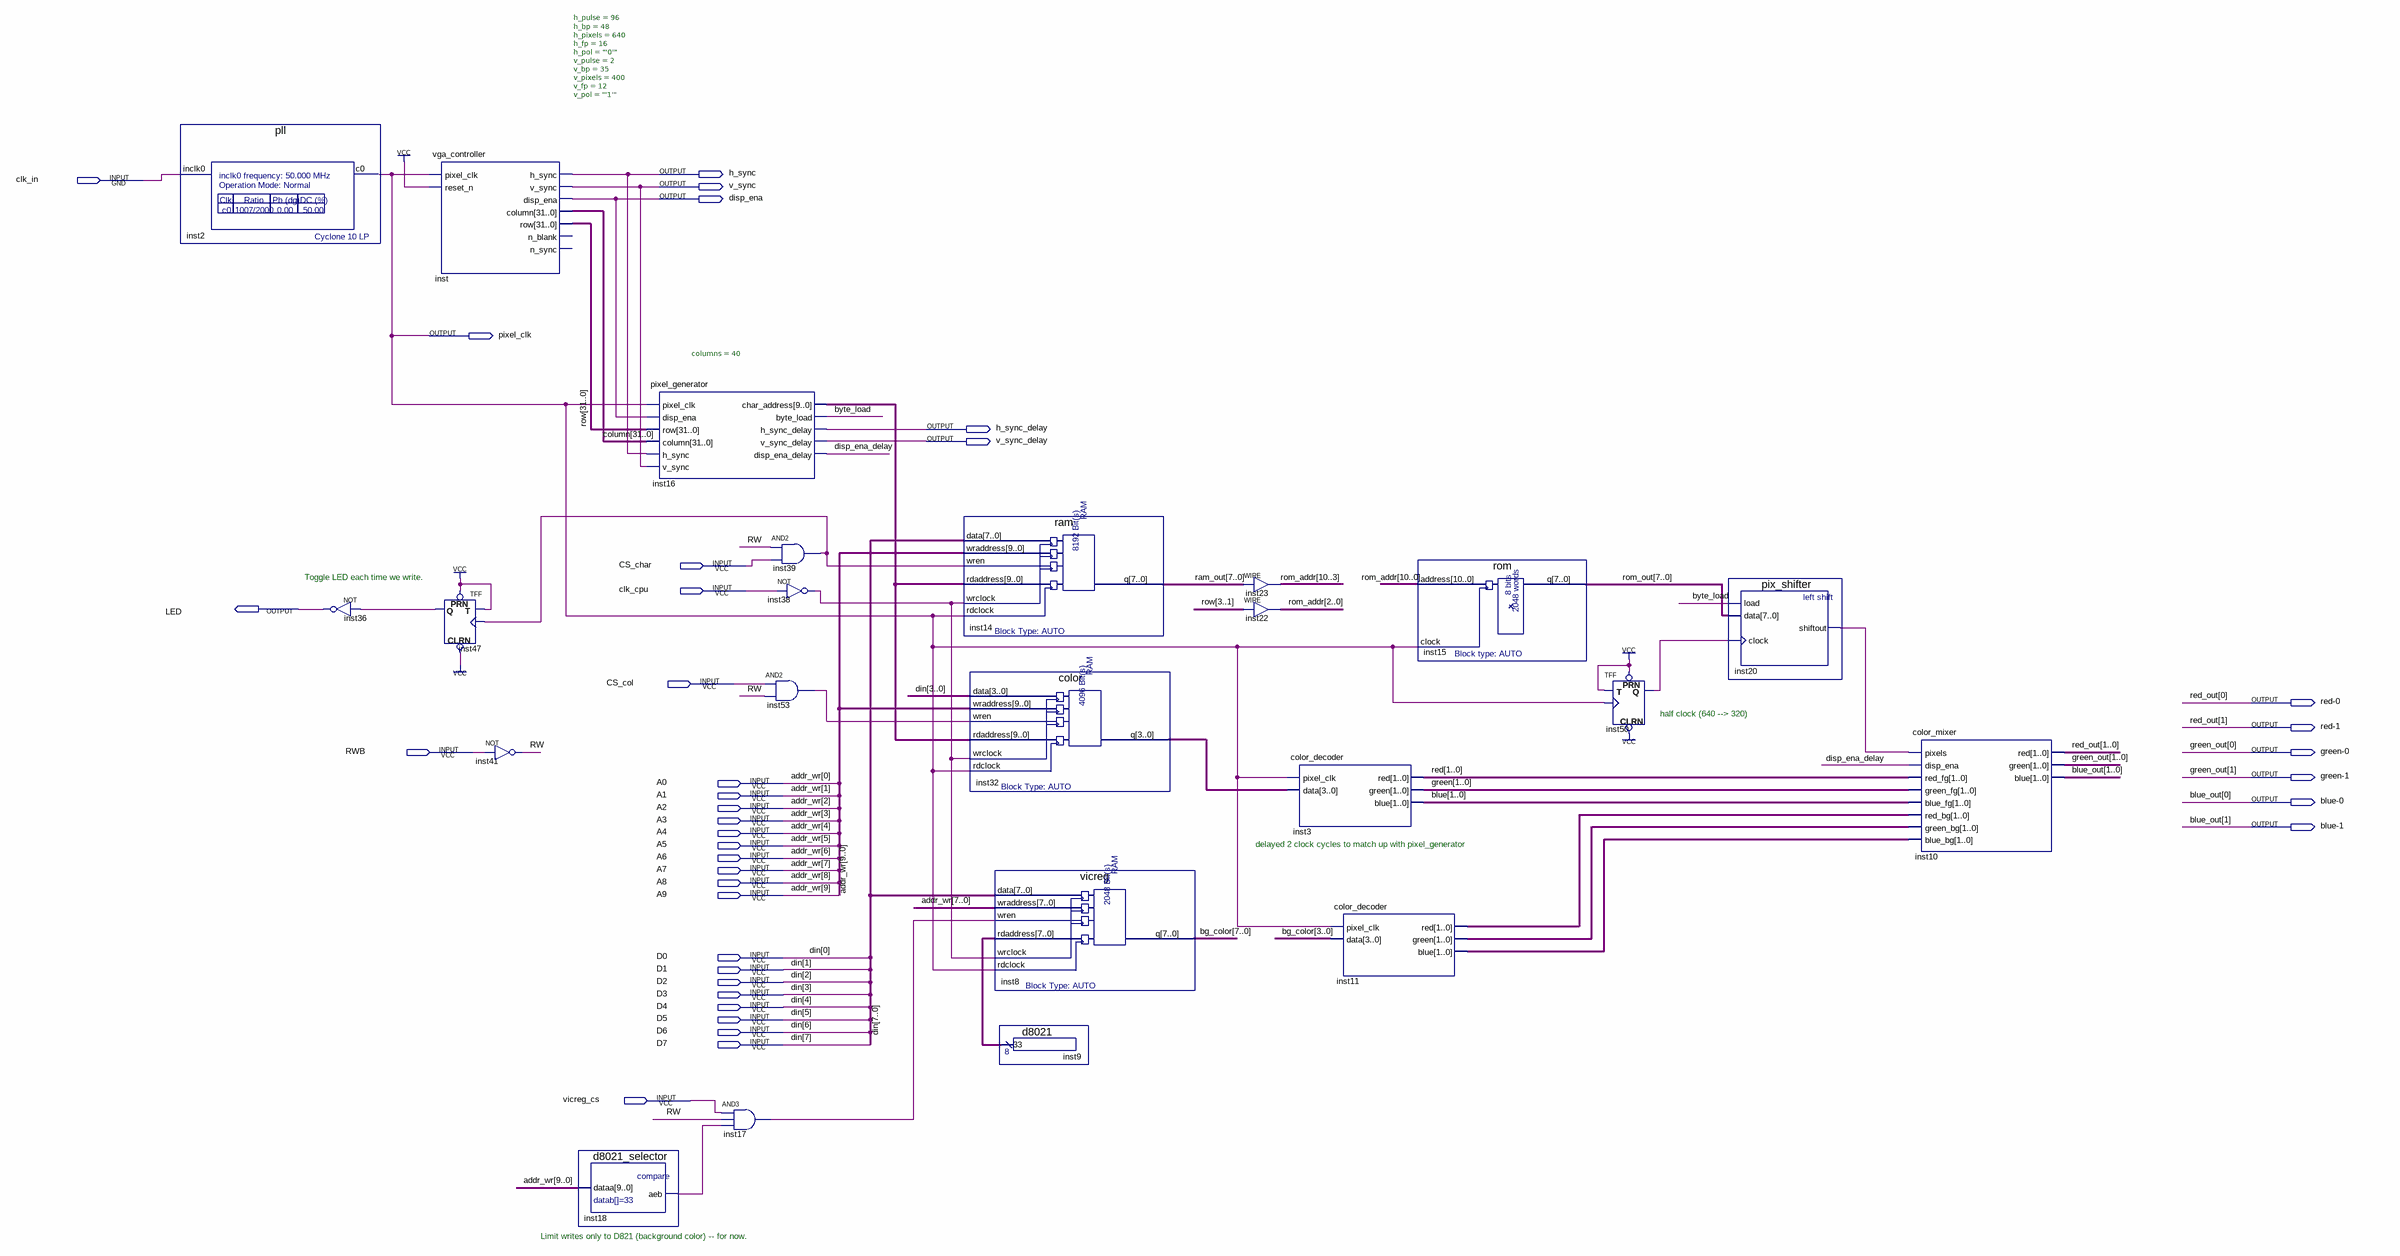
[diagram p0: schematic sheet]
// Quartus schematic VGA.bdf as structural Verilog: 23 symbols, 37 pins
module VGA (
  input  clk_in,
  input  CS_char,
  input  clk_cpu,
  input  CS_col,
  input  RWB,
  input  A0,
  input  A1,
  input  A2,
  input  A3,
  input  A4,
  input  A5,
  input  A6,
  input  A7,
  input  A8,
  input  A9,
  input  D0,
  input  D1,
  input  D2,
  input  D3,
  input  D4,
  input  D5,
  input  D6,
  input  D7,
  input  vicreg_cs,
  output h_sync,
  output v_sync,
  output disp_ena,
  output pixel_clk,
  output h_sync_delay,
  output v_sync_delay,
  output LED,
  output \red-0 ,
  output \red-1 ,
  output \green-0 ,
  output \green-1 ,
  output \blue-0 ,
  output \blue-1 
);

  wire byte_load, disp_ena_delay, inst17_out, inst18_aeb, inst20_shiftout, inst38_out, inst39_out, inst47_q,
       inst50_q, inst53_out, RW;
  wire [1:0] blue, green, inst11_blue, inst11_green, inst11_red, red;
  wire [3:0] inst32_q;
  wire [7:0] bg_color, inst9_result, ram_out, rom_out;
  wire [9:0] inst16_char_address;
  wire [10:0] rom_addr;
  wire [31:0] column, row;

  pll inst2 (.inclk0(clk_in), .c0(pixel_clk));
  not inst36 (LED, inst47_q);
  vga_controller #(.h_pulse(96), .h_bp(48), .h_pixels(640), .h_fp(16), .h_pol("'0'"), .v_pulse(2), .v_bp(35), .v_pixels(400), .v_fp(12), .v_pol("'1'")) inst (
    .pixel_clk(pixel_clk), .reset_n(1'b1), .h_sync(h_sync), .v_sync(v_sync), .disp_ena(disp_ena),
    .column(column), .row(row));  // open: n_blank, n_sync
  TFF inst47 (.PRN(1'b1), .CLRN(1'b1), .T(1'b1), .CLK(inst39_out), .Q(inst47_q));
  not inst41 (RW, RWB);
  d8021_selector inst18 (.dataa({A9, A8, A7, A6, A5, A4, A3, A2, A1, A0}), .aeb(inst18_aeb));
  pixel_generator #(.columns(40)) inst16 (
    .pixel_clk(pixel_clk), .disp_ena(disp_ena), .row(row), .column(column), .h_sync(h_sync), .v_sync(v_sync),
    .char_address(inst16_char_address), .byte_load(byte_load), .h_sync_delay(h_sync_delay),
    .v_sync_delay(v_sync_delay), .disp_ena_delay(disp_ena_delay));
  and inst17 (inst17_out, vicreg_cs, RW, inst18_aeb);
  and inst39 (inst39_out, RW, CS_char);
  not inst38 (inst38_out, clk_cpu);
  and inst53 (inst53_out, CS_col, RW);
  ram inst14 (
    .data({D7, D6, D5, D4, D3, D2, D1, D0}), .wraddress({A9, A8, A7, A6, A5, A4, A3, A2, A1, A0}),
    .wren(inst39_out), .rdaddress(inst16_char_address), .wrclock(inst38_out), .rdclock(pixel_clk), .q(ram_out));
  color inst32 (
    .data({D3, D2, D1, D0}), .wraddress({A9, A8, A7, A6, A5, A4, A3, A2, A1, A0}), .wren(inst53_out),
    .rdaddress(inst16_char_address), .wrclock(inst38_out), .rdclock(pixel_clk), .q(inst32_q));
  vicreg inst8 (
    .data({D7, D6, D5, D4, D3, D2, D1, D0}), .wraddress({A7, A6, A5, A4, A3, A2, A1, A0}), .wren(inst17_out),
    .rdaddress(inst9_result), .wrclock(inst38_out), .rdclock(pixel_clk), .q(bg_color));
  d8021 inst9 (.result(inst9_result));
  assign rom_addr[10:3] = ram_out;  // WIRE inst23
  assign rom_addr[2:0] = row[3:1];  // WIRE inst22
  color_decoder inst3 (.pixel_clk(pixel_clk), .data(inst32_q), .red(red), .green(green), .blue(blue));
  color_decoder inst11 (
    .pixel_clk(pixel_clk), .data(bg_color[3:0]), .red(inst11_red), .green(inst11_green), .blue(inst11_blue));
  rom inst15 (.address(rom_addr), .clock(pixel_clk), .q(rom_out));
  TFF inst50 (.PRN(1'b1), .CLRN(1'b1), .T(1'b1), .CLK(pixel_clk), .Q(inst50_q));
  pix_shifter inst20 (.load(byte_load), .data(rom_out), .clock(inst50_q), .shiftout(inst20_shiftout));
  color_mixer inst10 (
    .pixels(inst20_shiftout), .disp_ena(disp_ena_delay), .red_fg(red), .green_fg(green), .blue_fg(blue),
    .red_bg(inst11_red), .green_bg(inst11_green), .blue_bg(inst11_blue), .red({\red-1 , \red-0 }),
    .green({\green-1 , \green-0 }), .blue({\blue-1 , \blue-0 }));

  // Other names for the same wires on the sheet: addr_wr[9:0] = {A9, A8, A7, A6, A5, A4, A3, A2, A1, A0};
  //   blue_out[1:0] = {\blue-1 , \blue-0 }; din[7:0] = {D7, D6, D5, D4, D3, D2, D1, D0};
  //   green_out[1:0] = {\green-1 , \green-0 }; red_out[1:0] = {\red-1 , \red-0 }

  // Notes on the sheet:
  //   Toggle LED each time we write.
  //   half clock (640 --> 320)
  //   delayed 2 clock cycles to match up with pixel_generator
  //   Limit writes only to D821 (background color) -- for now.
endmodule
